# Altium project GRHV_4_Tube_v0.1.PrjPcb
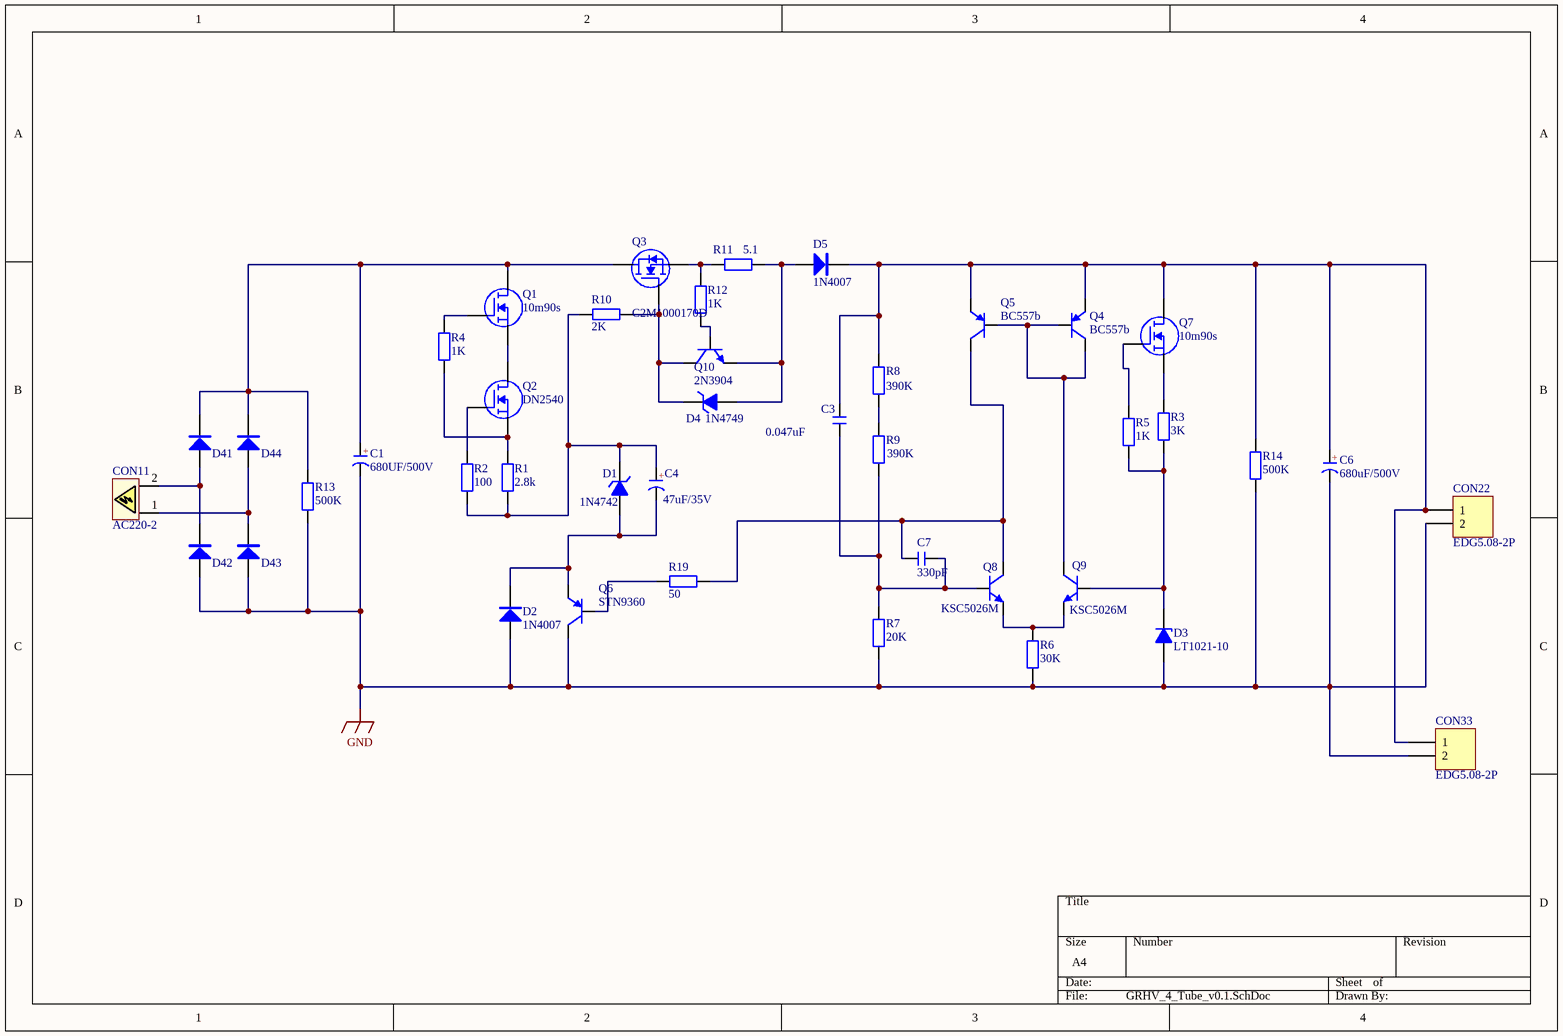
[diagram p0: GRHV_4_Tube_v0.1.SchDoc]
1 sheet, 42 parts. Net scope: global (net labels, ports and power ports of the same name join across sheets).
Board file: GRHV_4_Tube_v0.1.PcbDoc

## Sheet GRHV_4_Tube_v0.1.SchDoc
size A4

### Parts
C1  680UF/500V  [CAP 11*35*60]
C3  0.047uF  [CBB 15*18*11]
C4  47uF/35V  [CAP 5.0*10*12.5]
C6  680uF/500V  [CAP 11*35*60]
C7  330pF  [CBB 6.3*6.3*5]
CON11  AC220-2  [HX5.08-2S]
CON22  EDG5.08-2P  [HX5.08-2L]
CON33  EDG5.08-2P  [HX5.08-2L]
D1  1N4742  [DO-41]
D2  1N4007  [DO-41]
D3  LT1021-10  [DIP8-300_MH]
D4  1N4749  [DO-41]
D5  1N4007  [DO-41]
D41  VS-HFA08TB60-M3  [TO220AC]  (value not drawn)
D42  VS-HFA08TB60-M3  [TO220AC]  (value not drawn)
D43  VS-HFA08TB60-M3  [TO220AC]  (value not drawn)
D44  VS-HFA08TB60-M3  [TO220AC]  (value not drawn)
Q1  10m90s  [TO220H]
Q2  DN2540  [TO220V]
Q3  C2M1000170D  [TO247H]
Q4  BC557b  [TO92A]
Q5  BC557b  [TO92A]
Q6  STN9360  [SOT223_L_Bottom]
Q7  10m90s  [TO220H]
Q8  KSC5026M  [TO126V]
Q9  KSC5026M  [TO126V]
Q10  2N3904  [TO92A]
R1  2.8k  [RS 1W]
R2  100  [RS 1W]
R3  3K  [RS 1W]
R4  1K  [RS 1W]
R5  1K  [RS 1W]
R6  30K  [RS 1W]
R7  20K  [RS 1W]
R8  390K  [RS 1W]
R9  390K  [RS 1W]
R10  2K  [RS 1W]
R11  5.1  [RS 2W]
R12  1K  [RS 1W]
R13  500K  [RS 1W]
R14  500K  [RS 1W]
R19  50  [RS 1W]

### Nets
GND: C1.2(K) C6.2(K) CON22.2 CON33.2 D2.1(A) D3.4(A) D42.2(Anode) D43.2(Anode) Q6.2(C) R6.1 R7.1 R13.1 R14.1
NetC1_1: C1.1(A) D41.1(Cathode) D44.1(Cathode) Q1.3(D) Q3.3(D) R13.2
NetC3_1: C3.1 C7.1 Q8.3(B) R7.2 R9.1
NetC3_2: C3.2 C6.1(A) CON22.1 CON33.1 D5.2(K) Q4.1(E) Q5.1(E) Q7.3(D) R8.2 R14.2
NetC4_1: C4.1(A) D1.2(K) R1.1 R2.1 R10.1
NetC4_2: C4.2(K) D1.1(A) D2.2(K) Q6.1(E)
NetC7_2: C7.2 Q5.2(C) Q8.2(C) R19.1
NetCON11_1: CON11.1(L) D43.1(Cathode) D44.2(Anode)
NetCON11_2: CON11.2(G) D41.2(Anode) D42.1(Cathode)
NetD3_6: D3.6(K) Q9.3(B) R3.2 R5.2
NetD4_1: D4.1(A) D5.1(A) Q10.1(E) R11.2
NetD4_2: D4.2(K) Q3.2(G) Q10.2(C) R10.2
NetQ1_1: Q1.1(S) Q2.3(D)
NetQ1_2: Q1.2(G) R4.2
NetQ2_1: Q2.1(S) R1.2 R4.1
NetQ2_2: Q2.2(G) R2.2
NetQ3_1: Q3.1(S) R11.1 R12.2
NetQ4_2: Q4.2(C) Q4.3(B) Q5.3(B) Q9.2(C)
NetQ6_3: Q6.3(B) R19.2
NetQ7_1: Q7.1(S) R3.1
NetQ7_2: Q7.2(G) R5.1
NetQ8_1: Q8.1(E) Q9.1(E) R6.2
NetQ10_3: Q10.3(B) R12.1
NetR8_1: R8.1 R9.2

### Notes on the sheet
- (in symbol C-CAP) +

### Library data of the parts
C1 C4 C6 = C-CAP: 直插电解电容; 版权归属: 源创客; BOM名称: 直插电解电容; 学习资源: www.ooocke.com
C3 C7 = C-CBB: CBB电容; 版权归属: 源创客; BOM名称: CBB电容; 学习资源: www.ooocke.com
D1 = 1N4742: 12V/1W稳压管
D2 D5 = 1N4007: 整流二极管; 版权归属: 源创客; BOM名称: 整流二极管; 学习资源: www.ooocke.com
D3 = LT1021-10-2P: 10V Precision Reference 2 Pin Config
D4 = 1N4749: 24V/1W稳压管
D41-D44 = VS-HFA08TB60-M3: Ultrafast Soft Recovery Diado 8A 600V
Q1 Q7 = 10m90s: IC恒流源  900v 100ma; pin to pad: 1>3 2>1 3>2
Q2 = DN2540: N沟道耗尽型DMOS场效应管 400V/150ma; pin to pad: 1>3 2>1 3>2
Q3 = C2M1000170D: N沟道增强型 Z-FET MOS场效应管 1000v 5A; pin to pad: 1>3 2>1 3>2
Q4 Q5 = BC557b: 音频放大-PNP型; pin to pad: 1>3 2>1 3>2
Q6 = STN9360: High Voltage fast switching PNP型 600v 500ma; pin to pad: 2>2+4
Q8 Q9 = KSC5026M: High Speed Switch -NPN型
Q10 = 2N3904: 通用三极管NPN型 40v 200ma; pin to pad: 2>3 3>2
R1-R14 R19 = R-CRR: 直插色环电阻; BOM名称: 色环电阻; 版权归属: 源创客; 学习资源: www.ooocke.com
  R8 R9: Value: 390K